# Altium schematic sheet 32-009原理图（源文件格式）.SchDoc
size A4
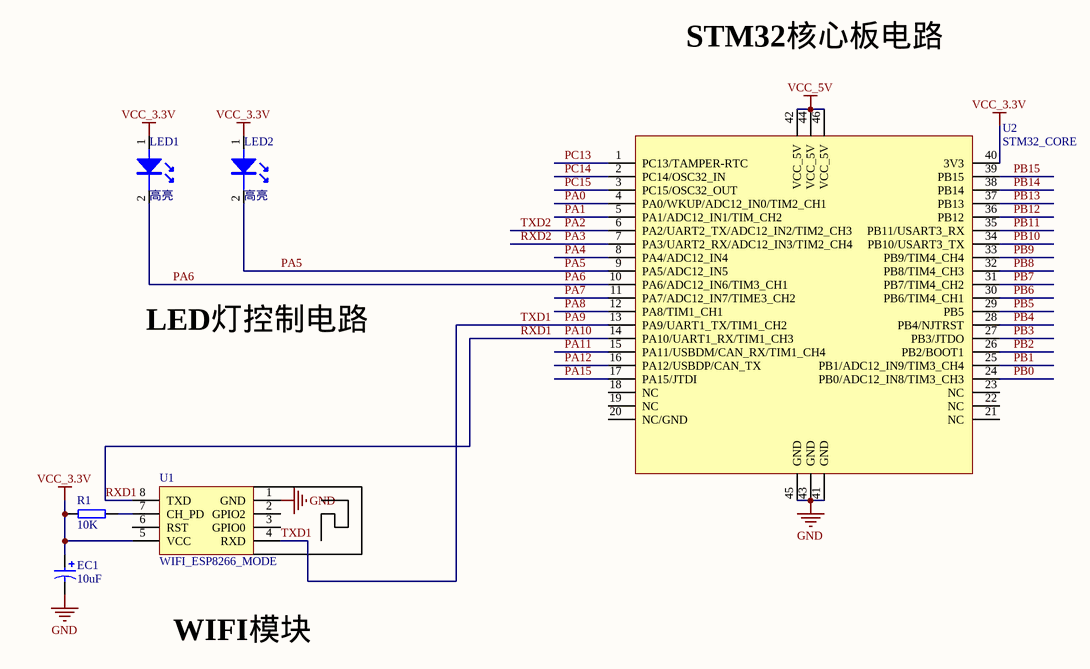
[diagram p0: 32-009原理图（源文件格式）.SchDoc]

## Parts
EC1  10uF  [RB.1/.2]
LED1  高亮  [LED_D3MM12]
LED2  高亮  [LED_D3MM12]
R1  10K  [AXIAL0.3]
U1  WIFI_ESP8266_MODE  [WIFI_ESP8266]
U2  STM32_CORE  [STM32_CORE]

## Nets
GND: EC1.2 U1.1(GND) U2.41(GND) U2.43(GND) U2.45(GND)
VCC_3.3V: EC1.1 LED1.1 LED2.1 R1.2 U1.5(VCC) U2.40(3V3)
VCC_5V: U2.42(VCC_5V) U2.44(VCC_5V) U2.46(VCC_5V)
PA0: U2.4(PA0/WKUP/ADC12_IN0/TIM2_CH1)
PA1: U2.5(PA1/ADC12_IN1/TIM_CH2)
PA2: U2.6(PA2/UART2_TX/ADC12_IN2/TIM2_CH3)  [also labelled TXD2]
PA3: U2.7(PA3/UART2_RX/ADC12_IN3/TIM2_CH4)  [also labelled RXD2]
PA4: U2.8(PA4/ADC12_IN4)
PA5: LED2.2 U2.9(PA5/ADC12_IN5)
PA6: LED1.2 U2.10(PA6/ADC12_IN6/TIM3_CH1)
PA7: U2.11(PA7/ADC12_IN7/TIME3_CH2)
PA8: U2.12(PA8/TIM1_CH1)
PA9: U1.4(RXD) U2.13(PA9/UART1_TX/TIM1_CH2)  [also labelled TXD1]
PA10: U1.8(TXD) U2.14(PA10/UART1_RX/TIM1_CH3)  [also labelled RXD1]
PA11: U2.15(PA11/USBDM/CAN_RX/TIM1_CH4)
PA12: U2.16(PA12/USBDP/CAN_TX)
PA15: U2.17(PA15/JTDI)
PB0: U2.24(PB0/ADC12_IN8/TIM3_CH3)
PB1: U2.25(PB1/ADC12_IN9/TIM3_CH4)
PB2: U2.26(PB2/BOOT1)
PB3: U2.27(PB3/JTDO)
PB4: U2.28(PB4/NJTRST)
PB5: U2.29(PB5)
PB6: U2.30(PB6/TIM4_CH1)
PB7: U2.31(PB7/TIM4_CH2)
PB8: U2.32(PB8/TIM4_CH3)
PB9: U2.33(PB9/TIM4_CH4)
PB10: U2.34(PB10/USART3_TX)
PB11: U2.35(PB11/USART3_RX)
PB12: U2.36(PB12)
PB13: U2.37(PB13)
PB14: U2.38(PB14)
PB15: U2.39(PB15)
PC13: U2.1(PC13/TAMPER-RTC)
PC14: U2.2(PC14/OSC32_IN)
PC15: U2.3(PC15/OSC32_OUT)
NetR1_1: R1.1 U1.7(CH_PD)

Not connected (* = marked no-connect by the designer): U1 2(GPIO2) 3(GPIO0) 6(RST); U2 18(NC) 19(NC) 20(NC/GND) 21(NC) 22(NC) 23(NC)

## Notes on the sheet
- STM32核心板电路
- LED灯控制电路
- WIFI模块

## Library data of the parts
EC1 = CAP_EC: 极性电容
LED1 LED2 = LED: LED灯
R1 = RES: 电阻
U1 = WIFI_ESP8266_MODE: ESP8266/WIFI模块
U2 = STM32_CORE: STM32核心板